# EAGLE schematic LightDiming2 (EAGLE 9.5.1)

## Sheet 1 of 2
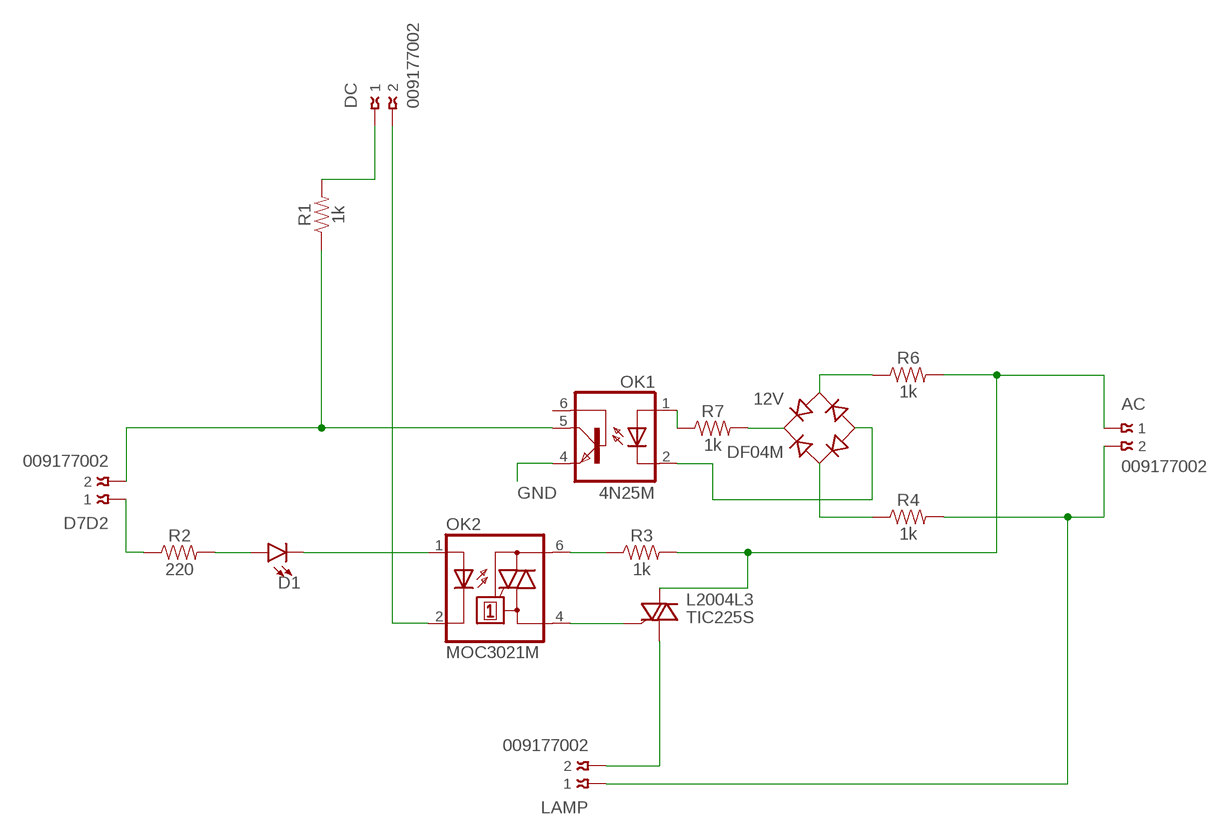
[diagram p0: schematic, sheet 1]

### Parts
AC  009177002  [009177002]
D1  LED1206  [LED-1206]
D7D2  009177002  [009177002]
DC  009177002  [009177002]
DF04M  12V  B-DIL  [B-DIL]
L2004L3  TIC225S  [TO220DS]
LAMP  009177002  [009177002]
OK1  4N25M  [DIL06]
OK2  MOC3021M  [DIL06]
R1  1k  1KOHM-HORIZ-1/4W-1%  [AXIAL-0.3]
R2  220  0.75OHM-0805-1/4W-1%  [0805]
R3  1k  1KOHM-HORIZ-1/4W-1%  [AXIAL-0.3]
R4  1k  1KOHM-HORIZ-1/4W-1%  [AXIAL-0.3]
R6  1k  1KOHM-HORIZ-1/4W-1%  [AXIAL-0.3]
R7  1k  0.75OHM-0805-1/4W-1%  [0805]

### Nets
GND: AC.2 LAMP.1 OK1.4(EMI) R4.P$2
IO2: D7D2.2 OK1.5(COL) R1.P$1
N$1: DF04M.+ R7.2
N$2: D1.A R2.2
N$3: D1.C OK2.1(A)
N$4: D7D2.1 R2.1
N$5: DC.1 R1.P$2
N$6: OK2.6(A2) R3.P$1
N$7: L2004L3.G OK2.4(A1)
N$8: OK1.1(A) R7.1
N$9: DF04M.- OK1.2(C)
N$10: DF04M.AC1 R4.P$1
N$11: DC.2 OK2.2(C)
N$12: AC.1 L2004L3.A2 R3.P$2 R6.P$2
N$13: DF04M.AC2 R6.P$1
N$15: L2004L3.A1 LAMP.2
Unconnected: OK1.6(BAS)

## Sheet 2 of 2

## Library data of the parts
AC D7D2 DC LAMP = con-avx:00917?002: Wire to Board Strip IDC Connector 2 WAY Source: http://www.avx.com/docs/Catalogs/9176.pdf http://www.avx.com/docs/Catalogs/9177.pdf; MPN: 009177002001006; OC_FARNELL: unknown; OC_NEWARK: 09P1124
D1 = SparkFun-LED:LED: LED (Generic) Standard schematic elements and footprints for 5mm, 3mm, 1206, and 0603 sized LEDs. Generic LEDs with no color specified.
DF04M = rectifier:B-DIL: RECTIFIER
L2004L3 = triac:TIC225S: TRIAC
OK1 = optocoupler:4N*?M: General Purpose 6-Pin Phototransistor Optocouplers Source: http://www.fairchildsemi.com/ds/4N/4N35-M.pdf; MPN: 4N25-M; OC_FARNELL: 1021349; OC_NEWARK: 98K9084
OK2 = optocoupler:MOC30*M: RANDOM-PHASE OPTOISOLATORS TRIAC DRIVER OUTPUT Source: http://www.fairchildsemi.com MOC3020-M.pdf; MF: FAIRCHILD SEMICONDUCTOR; MPN: MOC3021-M; OC_FARNELL: 1021365; OC_NEWARK: 95B7895
R1 R3 R4 R6 = SparkFun-Resistors:1KOHM: 1kΩ resistor A resistor is a passive two-terminal electrical component that implements electrical resistance as a circuit element. Resistors act to reduce current flow, and, at the same time, act to lower voltage levels within circuits. - Wikipedia; PROD_ID: RES-12182
R2 R7 = SparkFun-Resistors:0.75OHM: 0.75Ω resistor A resistor is a passive two-terminal electrical component that implements electrical resistance as a circuit element. Resistors act to reduce current flow, and, at the same time, act to lower voltage levels within circuits. - Wikipedia; PROD_ID: RES-08474; VALUE: 0.75